# Altium schematic sheet Gas_Sampler-3.3V_LDO.SchDoc: 3.3V LDO
size Tabloid; Organization: Sensible Robotics LLC; Address1: 120 E Church Ave Suite B; Address2: Ridgecrest CA, 93555; Revision: 0; SheetNumber: 5; SheetTotal: 12; ApprovedBy: Approved Name; Engineer: Mike Licitra; PageSetup: Record=PageOptions|CenterHorizontal=True|CenterVertical=True|PrintScale=0.98|XCorrection=1.00|YCorrection=1.00|PrintKind=0|BorderSize=5000000|LeftOffset=0|BottomOffset=0|Orientation=2|PaperLength=1000|PaperWidth=1000|Scale=100|PaperSource=15|PrintQuality=600|MediaType=1|DitherType=10|PaperKind=Tabloid|PrintScaleMode=1
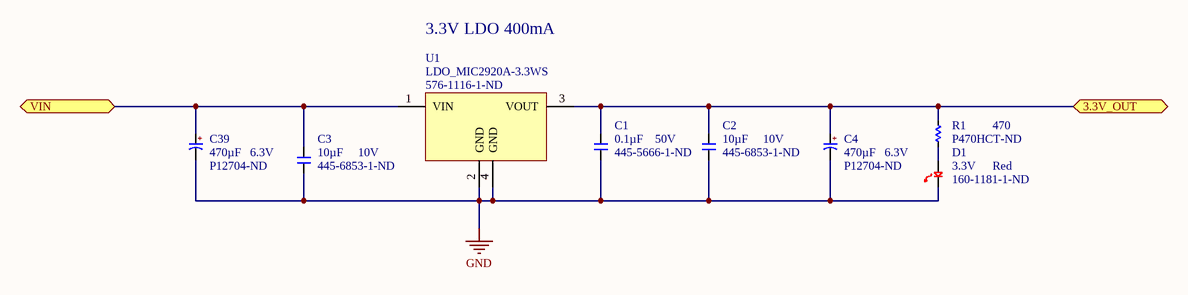
[diagram p0: Gas_Sampler-3.3V_LDO.SchDoc]

## Parts
C1  value 0.1µF  Voltage - Rated: 50V  Supplier Part Number 1: 445-5666-1-ND  [C0603]  (hidden comment: CAP_CER_0603_0.1UF_50V_10%_X7R)
C2  value 10µF  Voltage - Rated: 10V  Supplier Part Number 1: 445-6853-1-ND  [C0603]  (hidden comment: CAP_CER_0603_10UF_10V_20%_X5R)
C3  value 10µF  Voltage - Rated: 10V  Supplier Part Number 1: 445-6853-1-ND  [C0603]  (hidden comment: CAP_CER_0603_10UF_10V_20%_X5R)
C4  value 470µF  Voltage - Rated: 6.3V  Supplier Part Number 1: P12704-ND  [CAP_RADIAL_8MM_DIA_11.5MM_LEN_3.5MM_LEADSPACE]  (hidden comment: CAP_ALUM_470UF_6.3V_20%_RADIAL_8X11.5MM)
C39  value 470µF  Voltage - Rated: 6.3V  Supplier Part Number 1: P12704-ND  [CAP_RADIAL_8MM_DIA_11.5MM_LEN_3.5MM_LEADSPACE]  (hidden comment: CAP_ALUM_470UF_6.3V_20%_RADIAL_8X11.5MM)
D1  3.3V  Supplier Part Number 1: 160-1181-1-ND  Color: Red  [LED_0603_RED]
R1  value 470  Supplier Part Number 1: P470HCT-ND  [R0603]  (hidden comment: RES_0603_470_OHM_1/10W_1%)
U1  LDO_MIC2920A-3.3WS  Supplier Part Number 1: 576-1116-1-ND  [4SOT223]

## Ports
3.3V_OUT, VIN

## Nets
GND: C1.2 C2.2 C3.2 C4.2 C39.2 D1.2(CATHODE) U1.2(GND) U1.4(GND)
3.3V_OUT: C1.1 C2.1 C4.1 R1.2 U1.3(VOUT) ; port 3.3V_OUT
VIN: C3.1 C39.1 U1.1(VIN) ; port VIN
NetD1_1: D1.1(ANODE) R1.1

## Notes on the sheet
- 3.3V LDO 400mA
- CONFIDENTIAL DOCUMENT
- DUPLICATION PROHIBITED
- ENGINEER
- PCB FAB #
- SCH #
- REV
- Sensible
- Robotics
- THIS DOCUMENT CONTAINS INFORMATION AND OR DATA, WHICH IS PROPRIETARY AND CONFIDENTIAL TO SENSIBLE ROBOTICS LLC.  THIS INFORMATION AND OR DATA, IS TO BE USED ONLY FOR THE BENEFIT OF THE SUPPLIER, AND IS NOT TO BE USED FOR THE BENEFIT OF OTHER PARTIES WITHOUT WRITTEN CONSENT.
- DATE
- PCB ASSY #
- SIZE
- Tabloid
- SHEET
- OF
- FILE
- (in symbol CAP_ALUM_470UF_6.3V_20%_RADIAL_8X11.5MM) +

## Library data of the parts
C1 = CAP_CER_0603_0.1UF_50V_10%_X7R: CAP CER 0.1UF 50V 10% X7R 0603; Manufacturer: TDK Corporation; Manufacturer Part Number: CGA3E2X7R1H104K080AA; Part Number: 150-00077-00; Supplier 1: Digi-Key; RoHS: RoHS Compliant; Category: Capacitors; Stock 1: 320000; Pricing 1: 1=0.1, 10=0.072, 100=0.033, 250=0.027, 500=0.0231, 1000=0.018 (USD); Packaging: Cut Tape (CT); Tolerance: ±10%; Temperature Coefficient: X7R; Mounting Type: Surface Mount, MLCC; Operating Temperature: -55°C ~ 125°C; Applications: Automotive; Ratings: AEC-Q200; Package / Case: 0603 (1608 Metric); Size / Dimension: 0.063" L x 0.031" W (1.60mm x 0.80mm); Height - Seated (Max): -; Thickness (Max): 0.035" (0.90mm); Lead Spacing: -; Features: -; Lead Style: -; ComponentLink1URL: http://product.tdk.com/capacitor/mlcc/en/documents/mlcc_automotive_general_en.pdf; ComponentLink1Description: http://product.tdk.com/capacitor/mlcc/en/documents/mlcc_automotive_general_en.pdf
C2 C3 = CAP_CER_0603_10UF_10V_20%_X5R: CAP CER 10UF 10V X5R 0603; Manufacturer: TDK Corporation; Manufacturer Part Number: C1608X5R1A106M080AC; Tolerance: ±20%; Supplier 1: Digi-Key; RoHS: RoHS Compliant; Packaging: Cut Tape (CT); Part Status: Active; Temperature Coefficient: X5R; Operating Temperature: -55°C ~ 85°C; Features: Low ESL; Applications: General Purpose; Mounting Type: Surface Mount, MLCC; Package / Case: 0603 (1608 Metric); Size / Dimension: 0.063" L x 0.032" W (1.60mm x 0.80mm); Thickness (Max): 0.035" (0.90mm); ComponentLink1URL: https://product.tdk.com/info/en/catalog/datasheets/mlcc_commercial_general_en.pdf; ComponentLink1Description: https://product.tdk.com/info/en/catalog/datasheets/mlcc_commercial_general_en.pdf
C4 C39 = CAP_ALUM_470UF_6.3V_20%_RADIAL_8X11.5MM: CAP ALUM 470UF 6.3V 20% RADIAL; Manufacturer: Panasonic Electronic Components; Manufacturer Part Number: EEU-FC0J471; Part Number: 150-00053-00; Lifetime @ Temp.: 2000 Hrs @ 105°C; Ripple Current: 555mA; Impedance: 117 mOhm; Supplier 1: Digi-Key; RoHS: RoHS Compliant; Category: Capacitors; Stock 1: 89301; Pricing 1: 1=0.48, 50=0.2352, 100=0.2016, 500=0.1512, 1000=0.12768, 5000=0.11424, 10000=0.10752, 25000=0.1008 (USD); Packaging: Bulk; Tolerance: ±20%; Operating Temperature: -55°C ~ 105°C; Features: General Purpose; ESR (Equivalent Series Resistance): -; Mounting Type: Through Hole; Package / Case: Radial, Can; Size / Dimension: 0.315" Dia (8.00mm); Height - Seated (Max): 0.453" (11.50mm); Lead Spacing: 0.138" (3.50mm); Surface Mount Land Size: -; ComponentLink1URL: http://industrial.panasonic.com/www-cgi/jvcr13pz.cgi?E+PZ+3+ABA0022+EEUFC0J471+7+WW; ComponentLink1Description: http://industrial.panasonic.com/www-cgi/jvcr13pz.cgi?E+PZ+3+ABA0022+EEUFC0J471+7+WW
D1 = LED_0603_RED_LR_LTST-C190CKT: LED RED CLEAR 0603 SMD; Manufacturer: Lite-On Inc; Millicandela Rating: 10mcd; Wavelength - Dominant: 638nm; Wavelength - Peak: 660nm; Viewing Angle: 130°; Lens Style/Size: Rectangle with Flat Top, 1.1mm x 0.8mm; Voltage - Forward (Vf) Typ: 1.8V; Current - Test: 10mA; Supplier 1: Digi-Key; Manufacturer Part Number: LTST-C190CKT; Lens Type: Clear; Package / Case: 0603 (1608 Metric); Size / Dimension: 1.60mm L x 0.80mm W; Height: 0.80mm; Mounting Type: Surface Mount; Packaging: Cut Tape (CT); ComponentLink1URL: http://media.digikey.com/pdf/Data%20Sheets/Lite-On%20PDFs/LTST-C190CKT.pdf; ComponentLink1Description: Datasheet
R1 = RES_0603_470_OHM_1/10W_1%: RES 470 OHM 1/10W 1% 0603 SMD; Manufacturer: Panasonic Electronic Components; Manufacturer Part Number: ERJ-3EKF4700V; Part Number: 470-00157-00; Power (Watts): 0.1W, 1/10W; Temperature Coefficient: ±100ppm/°C; Supplier 1: Digi-Key; RoHS: RoHS Compliant; Category: Resistors; Stock 1: 212428; Pricing 1: 1=0.1, 50=0.0138, 100=0.0105, 250=0.0078, 500=0.00576, 1000=0.00384 (USD); Packaging: Cut Tape (CT); Composition: Thick Film; Features: -; Tolerance: ±1%; Package / Case: 0603 (1608 Metric); Supplier Device Package: 0603; Size / Dimension: 0.063" L x 0.031" W (1.60mm x 0.80mm); Height: 0.022" (0.55mm); Number of Terminations: 2; ComponentLink1URL: http://industrial.panasonic.com/www-cgi/jvcr13pz.cgi?E+PZ+3+AOA0002+ERJ3EKF4700V+7+WW; ComponentLink1Description: http://industrial.panasonic.com/www-cgi/jvcr13pz.cgi?E+PZ+3+AOA0002+ERJ3EKF4700V+7+WW
U1 = LDO_MIC2920A-3.3WS: IC REG LDO 3.3V 0.4A SOT223; Manufacturer: Microchip Technology; Manufacturer Part Number: MIC2920A-3.3WS-TR; Regulator Topology: Positive Fixed; Current - Output: 400mA; Voltage - Dropout (Typical): 0.4V @ 400mA; Number of Regulators: 1; Voltage - Input: Up to 26V; Supplier 1: Digi-Key; Packaging: Cut Tape (CT); Voltage - Output: 3.3V; Operating Temperature: -40°C ~ 125°C; Mounting Type: Surface Mount; Package / Case: TO-261-4, TO-261AA; Supplier Device Package: SOT-223; ComponentLink1URL: http://www.microchip.com/mymicrochip/filehandler.aspx?ddocname=en580793; ComponentLink1Description: http://www.microchip.com/mymicrochip/filehandler.aspx?ddocname=en580793